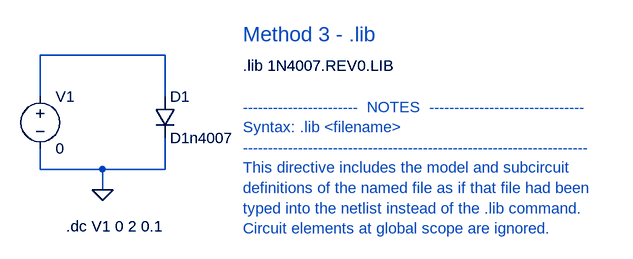
[diagram p0: schematic LTspice 06-1 Import SPICE model_method3 .lib.asc]
LTspice 06-1 Import SPICE model_method3 .lib.asc, the LTspice schematic file:
Version 4
SHEET 1 3292 680
WIRE 976 -160 784 -160
WIRE 784 -96 784 -160
WIRE 976 -96 976 -160
WIRE 784 16 784 -16
WIRE 880 16 784 16
WIRE 976 16 976 -32
WIRE 976 16 880 16
WIRE 880 48 880 16
FLAG 880 48 0
SYMBOL voltage 784 -112 R0
SYMATTR InstName V1
SYMATTR Value 0
SYMBOL diode 960 -96 R0
SYMATTR InstName D1
SYMATTR Value D1n4007
TEXT 824 104 Left 2 !.dc V1 0 2 0.1
TEXT 1096 -192 Left 3 ;Method 3 - .lib
TEXT 1096 -80 Left 2 ;-----------------------  NOTES  -------------------------------\nSyntax: .lib <filename>\n---------------------------------------------------------------------\nThis directive includes the model and subcircuit \ndefinitions of the named file as if that file had been \ntyped into the netlist instead of the .lib command. \nCircuit elements at global scope are ignored.
TEXT 1096 -144 Left 2 !.lib 1N4007.REV0.LIB

The netlist it stands for:
* LTspice 06-1 Import SPICE model_method3 .lib.asc
V1 N001 0 0
D1 N001 0 D1n4007
.model D D
.lib standard.dio
.dc V1 0 2 0.1
* Method 3 - .lib
* -----------------------  NOTES  -------------------------------
* Syntax: .lib <filename>
* ---------------------------------------------------------------------
* This directive includes the model and subcircuit
* definitions of the named file as if that file had been
* typed into the netlist instead of the .lib command.
* Circuit elements at global scope are ignored.
.lib 1N4007.REV0.LIB
.backanno
.end